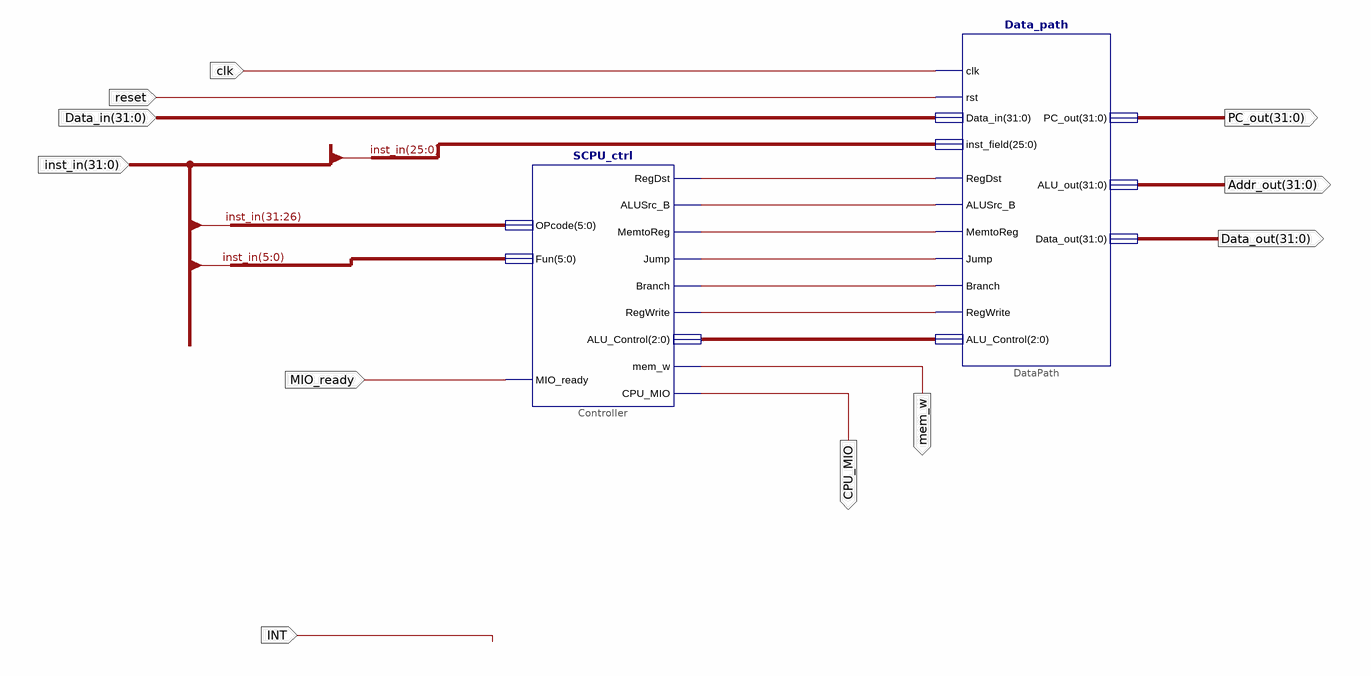
[diagram p0: schematic sheet 1]
// Xilinx ISE schematic SCPU.sch (kintex7) as structural Verilog: 2 symbols, 11 ports
module SCPU (
  input  MIO_ready,
  input  clk,
  input  reset,
  input  [31:0] Data_in,
  input  [31:0] inst_in,
  input  INT,
  output mem_w,
  output CPU_MIO,
  output [31:0] PC_out,
  output [31:0] Addr_out,
  output [31:0] Data_out
);

  wire XLXN_32, XLXN_33, XLXN_34, XLXN_35, XLXN_36, XLXN_39;
  wire [2:0] XLXN_41;

  Data_path DataPath (
    .RegDst(XLXN_32), .ALUSrc_B(XLXN_33), .MemtoReg(XLXN_34), .Jump(XLXN_35), .Branch(XLXN_36),
    .RegWrite(XLXN_39), .ALU_Control(XLXN_41), .Data_in(Data_in), .inst_field(inst_in[25:0]), .clk(clk),
    .rst(reset), .PC_out(PC_out), .ALU_out(Addr_out), .Data_out(Data_out));
  SCPU_ctrl Controller (
    .RegDst(XLXN_32), .ALUSrc_B(XLXN_33), .MemtoReg(XLXN_34), .Jump(XLXN_35), .Branch(XLXN_36),
    .RegWrite(XLXN_39), .ALU_Control(XLXN_41), .CPU_MIO(CPU_MIO), .mem_w(mem_w), .Fun(inst_in[5:0]),
    .MIO_ready(MIO_ready), .OPcode(inst_in[31:26]));
endmodule
